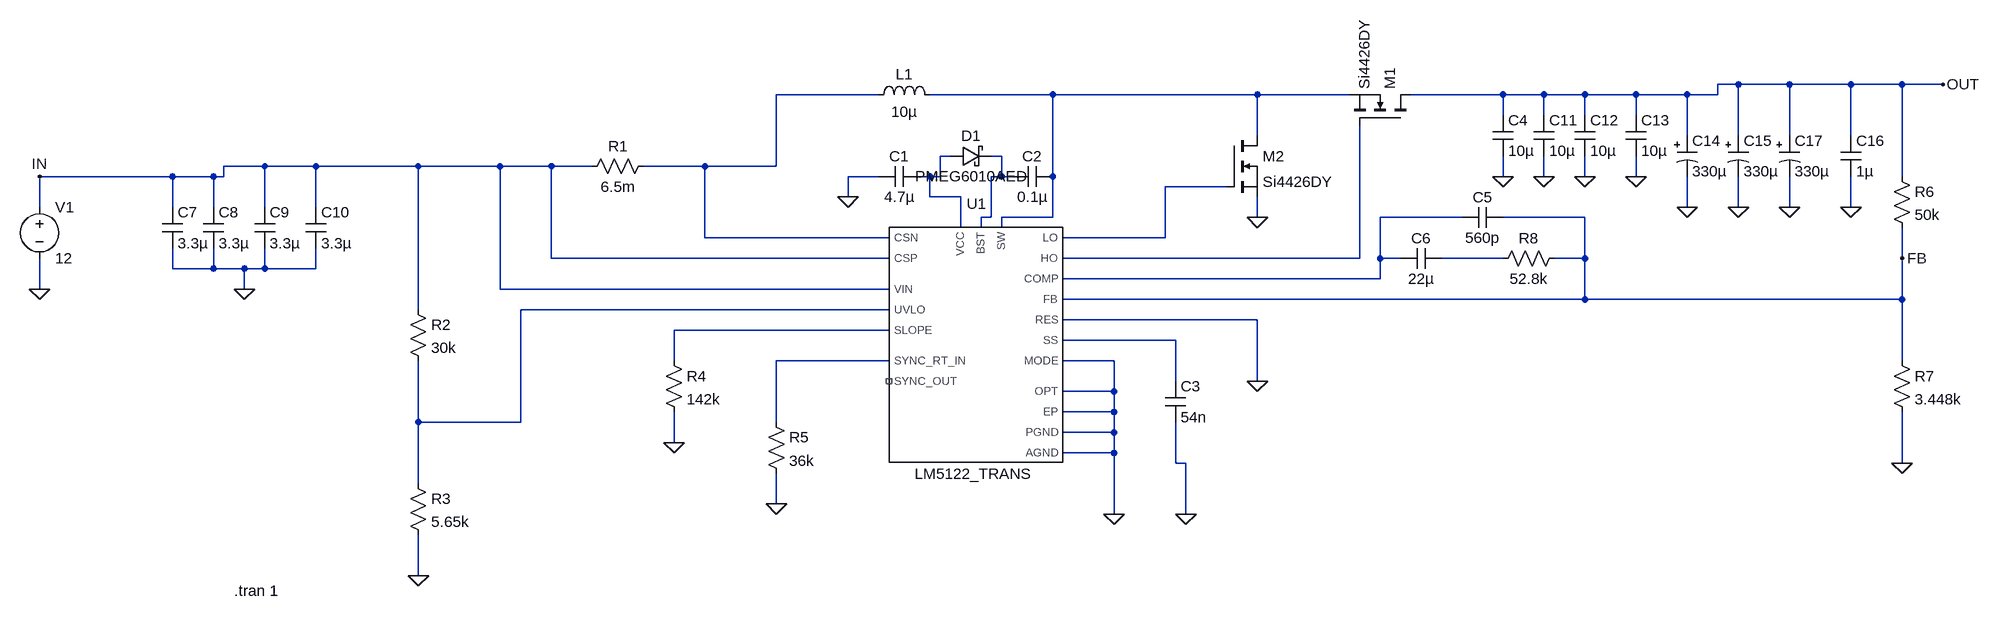
[diagram p0: schematic Simu_Boost_18V.asc]
Simu_Boost_18V.asc, the LTspice schematic file:
Version 4
SHEET 1 1940 680
WIRE 1552 -256 1520 -256
WIRE 1632 -256 1552 -256
WIRE 1728 -256 1632 -256
WIRE 1808 -256 1728 -256
WIRE 1872 -256 1808 -256
WIRE 208 -240 48 -240
WIRE 480 -240 288 -240
WIRE 800 -240 480 -240
WIRE 944 -240 800 -240
WIRE 1184 -240 1040 -240
WIRE 1248 -240 1184 -240
WIRE 1312 -240 1248 -240
WIRE 1392 -240 1312 -240
WIRE 1472 -240 1392 -240
WIRE 1520 -240 1520 -256
WIRE 1520 -240 1472 -240
WIRE 1184 -208 1184 -240
WIRE 1248 -208 1248 -240
WIRE 1312 -208 1312 -240
WIRE 1392 -208 1392 -240
WIRE 800 -176 800 -240
WIRE 1472 -176 1472 -240
WIRE 1552 -176 1552 -256
WIRE 1632 -176 1632 -256
WIRE 1728 -176 1728 -256
WIRE 320 -144 304 -144
WIRE 400 -144 384 -144
WIRE -752 -128 -816 -128
WIRE -672 -128 -752 -128
WIRE -512 -128 -672 -128
WIRE -384 -128 -512 -128
WIRE -304 -128 -384 -128
WIRE -240 -128 -304 -128
WIRE -64 -128 -160 -128
WIRE 48 -128 48 -240
WIRE 48 -128 -64 -128
WIRE -896 -112 -1104 -112
WIRE -832 -112 -896 -112
WIRE -816 -112 -816 -128
WIRE -816 -112 -832 -112
WIRE 208 -112 160 -112
WIRE 288 -112 272 -112
WIRE 304 -112 304 -144
WIRE 304 -112 288 -112
WIRE 400 -112 400 -144
WIRE 400 -112 384 -112
WIRE 416 -112 400 -112
WIRE 480 -112 480 -240
WIRE 1184 -112 1184 -144
WIRE 1248 -112 1248 -144
WIRE 1312 -112 1312 -144
WIRE 1392 -112 1392 -144
WIRE 1808 -112 1808 -256
WIRE 752 -96 656 -96
WIRE 160 -80 160 -112
WIRE 288 -80 288 -112
WIRE 336 -80 288 -80
WIRE -1104 -64 -1104 -112
WIRE -896 -64 -896 -112
WIRE -832 -64 -832 -112
WIRE -752 -64 -752 -128
WIRE -672 -64 -672 -128
WIRE 1472 -64 1472 -112
WIRE 1552 -64 1552 -112
WIRE 1632 -64 1632 -112
WIRE 1728 -64 1728 -112
WIRE 384 -48 384 -112
WIRE 384 -48 368 -48
WIRE 480 -48 480 -112
WIRE 480 -48 400 -48
WIRE 800 -48 800 -80
WIRE 1120 -48 992 -48
WIRE 1312 -48 1184 -48
WIRE 336 -32 336 -80
WIRE 368 -32 368 -48
WIRE 400 -32 400 -48
WIRE -64 -16 -64 -128
WIRE 224 -16 -64 -16
WIRE 656 -16 656 -96
WIRE 656 -16 496 -16
WIRE -304 16 -304 -128
WIRE 224 16 -304 16
WIRE 960 16 960 -192
WIRE 960 16 496 16
WIRE 992 16 992 -48
WIRE 1024 16 992 16
WIRE 1184 16 1088 16
WIRE 1312 16 1312 -48
WIRE 1312 16 1264 16
WIRE 1808 16 1808 -32
WIRE -896 32 -896 0
WIRE -832 32 -832 0
WIRE -832 32 -896 32
WIRE -784 32 -832 32
WIRE -752 32 -752 0
WIRE -752 32 -784 32
WIRE -672 32 -672 0
WIRE -672 32 -752 32
WIRE 992 48 992 16
WIRE 992 48 496 48
WIRE -1104 64 -1104 16
WIRE -784 64 -784 32
WIRE -384 64 -384 -128
WIRE 224 64 -384 64
WIRE 1312 80 1312 16
WIRE 1312 80 496 80
WIRE 1808 80 1808 16
WIRE 1808 80 1312 80
WIRE -512 96 -512 -128
WIRE 224 96 -352 96
WIRE 800 112 496 112
WIRE 224 128 -112 128
WIRE 672 144 496 144
WIRE -112 176 -112 128
WIRE 224 176 48 176
WIRE 576 176 496 176
WIRE 1808 176 1808 80
WIRE 672 208 672 144
WIRE 800 208 800 112
WIRE 576 224 576 176
WIRE 576 224 496 224
WIRE 576 256 576 224
WIRE 576 256 496 256
WIRE -512 272 -512 176
WIRE -352 272 -352 96
WIRE -352 272 -512 272
WIRE 48 272 48 176
WIRE 576 288 576 256
WIRE 576 288 496 288
WIRE -112 304 -112 256
WIRE 576 320 576 288
WIRE 576 320 496 320
WIRE 672 336 672 272
WIRE 688 336 672 336
WIRE 1808 336 1808 256
WIRE -512 368 -512 272
WIRE 48 400 48 352
WIRE 576 416 576 320
WIRE 688 416 688 336
WIRE -512 512 -512 448
FLAG -512 512 0
FLAG -112 304 0
FLAG 48 400 0
FLAG 160 -80 0
FLAG 576 416 0
FLAG 688 416 0
FLAG 800 208 0
FLAG 1808 336 0
FLAG 800 -48 0
FLAG 1872 -256 OUT
FLAG -1104 64 0
FLAG -1104 -112 IN
FLAG 1808 16 FB
FLAG -784 64 0
FLAG 1184 -112 0
FLAG 1248 -112 0
FLAG 1312 -112 0
FLAG 1392 -112 0
FLAG 1472 -64 0
FLAG 1552 -64 0
FLAG 1632 -64 0
FLAG 1728 -64 0
SYMBOL LM5122_TRANS 352 144 R0
SYMATTR InstName U1
SYMBOL voltage -1104 -80 R0
WINDOW 123 0 0 Left 0
WINDOW 39 0 0 Left 0
SYMATTR InstName V1
SYMATTR Value 12
SYMBOL res -144 -144 R90
WINDOW 0 0 56 VBottom 2
WINDOW 3 32 56 VTop 2
SYMATTR InstName R1
SYMATTR Value 6.5m
SYMBOL res -528 80 R0
SYMATTR InstName R2
SYMATTR Value 30k
SYMBOL res -528 352 R0
SYMATTR InstName R3
SYMATTR Value 5.65k
SYMBOL res -128 160 R0
SYMATTR InstName R4
SYMATTR Value 142k
SYMBOL res 32 256 R0
SYMATTR InstName R5
SYMATTR Value 36k
SYMBOL ind 192 -224 R270
WINDOW 0 32 56 VTop 2
WINDOW 3 5 56 VBottom 2
SYMATTR InstName L1
SYMATTR Value 10µ
SYMATTR SpiceLine Ipk=10 Rser=16.5m
SYMBOL cap 272 -128 R90
WINDOW 0 0 32 VBottom 2
WINDOW 3 32 32 VTop 2
SYMATTR InstName C1
SYMATTR Value 4.7µ
SYMBOL schottky 320 -128 R270
WINDOW 0 32 32 VTop 2
WINDOW 3 0 32 VBottom 2
SYMATTR InstName D1
SYMATTR Value PMEG6010AED
SYMATTR Description Diode
SYMATTR Type diode
SYMBOL cap 480 -128 R90
WINDOW 0 0 32 VBottom 2
WINDOW 3 32 32 VTop 2
SYMATTR InstName C2
SYMATTR Value 0.1µ
SYMBOL cap 656 208 R0
SYMATTR InstName C3
SYMATTR Value 54n
SYMBOL res 1792 -128 R0
SYMATTR InstName R6
SYMATTR Value 50k
SYMBOL res 1792 160 R0
SYMATTR InstName R7
SYMATTR Value 3.448k
SYMBOL cap 1184 -64 R90
WINDOW 0 0 32 VBottom 2
WINDOW 3 32 32 VTop 2
SYMATTR InstName C5
SYMATTR Value 560p
SYMBOL cap 1088 0 R90
WINDOW 0 0 32 VBottom 2
WINDOW 3 32 32 VTop 2
SYMATTR InstName C6
SYMATTR Value 22µ
SYMBOL res 1280 0 R90
WINDOW 0 0 56 VBottom 2
WINDOW 3 32 56 VTop 2
SYMATTR InstName R8
SYMATTR Value 52.8k
SYMBOL nmos 752 -176 R0
SYMATTR InstName M2
SYMATTR Value Si4426DY
SYMBOL nmos 1040 -192 M270
SYMATTR InstName M1
SYMATTR Value Si4426DY
SYMBOL cap -912 -64 R0
SYMATTR InstName C7
SYMATTR Value 3.3µ
SYMBOL cap -848 -64 R0
SYMATTR InstName C8
SYMATTR Value 3.3µ
SYMBOL cap -768 -64 R0
SYMATTR InstName C9
SYMATTR Value 3.3µ
SYMBOL cap -688 -64 R0
SYMATTR InstName C10
SYMATTR Value 3.3µ
SYMBOL cap 1168 -208 R0
SYMATTR InstName C4
SYMATTR Value 10µ
SYMBOL cap 1232 -208 R0
SYMATTR InstName C11
SYMATTR Value 10µ
SYMBOL cap 1296 -208 R0
SYMATTR InstName C12
SYMATTR Value 10µ
SYMBOL cap 1376 -208 R0
SYMATTR InstName C13
SYMATTR Value 10µ
SYMBOL polcap 1456 -176 R0
SYMATTR InstName C14
SYMATTR Value 330µ
SYMBOL polcap 1536 -176 R0
SYMATTR InstName C15
SYMATTR Value 330µ
SYMBOL cap 1712 -176 R0
SYMATTR InstName C16
SYMATTR Value 1µ
SYMBOL polcap 1616 -176 R0
SYMATTR InstName C17
SYMATTR Value 330µ
TEXT -800 536 Left 2 !.tran 1

The netlist it stands for:
* Simu_Boost_18V.asc
XU1 N010 0 FB N007 N005 N011 N002 0 0 0 N004 N006 NC_01 N012 N001 IN N003 IN N009 0 0 LM5122_TRANS  ; pins SLOPE RES FB HO LO SS SW PGND MODE AGND BST COMP SYNC_OUT SYNC_RT_IN CSN CSP VCC VIN UVLO OPT EP
V1 IN 0 12
R1 N001 IN 6.5m
R2 IN N009 30k
R3 N009 0 5.65k
R4 N010 0 142k
R5 N012 0 36k
L1 N001 N002 10µ Ipk=10 Rser=16.5m
C1 N003 0 4.7µ
D1 N003 N004 PMEG6010AED
C2 N002 N004 0.1µ
C3 N011 0 54n
R6 OUT FB 50k
R7 FB 0 3.448k
C5 FB N006 560p
C6 N008 N006 22µ
R8 FB N008 52.8k
M2 N002 N005 0 0 Si4426DY
M1 OUT N007 N002 N002 Si4426DY
C7 IN 0 3.3µ
C8 IN 0 3.3µ
C9 IN 0 3.3µ
C10 IN 0 3.3µ
C4 OUT 0 10µ
C11 OUT 0 10µ
C12 OUT 0 10µ
C13 OUT 0 10µ
C14 OUT 0 330µ
C15 OUT 0 330µ
C16 OUT 0 1µ
C17 OUT 0 330µ
.model D D
.lib standard.dio
.model NMOS NMOS
.model PMOS PMOS
.lib standard.mos
.tran 1
.lib C:\Users\Lilian\Downloads\LM5122_PSPICE_TRANS\LM5122_TRANS.LIB
.backanno
.end